# EAGLE design sd shield (EAGLE 7.3.0)
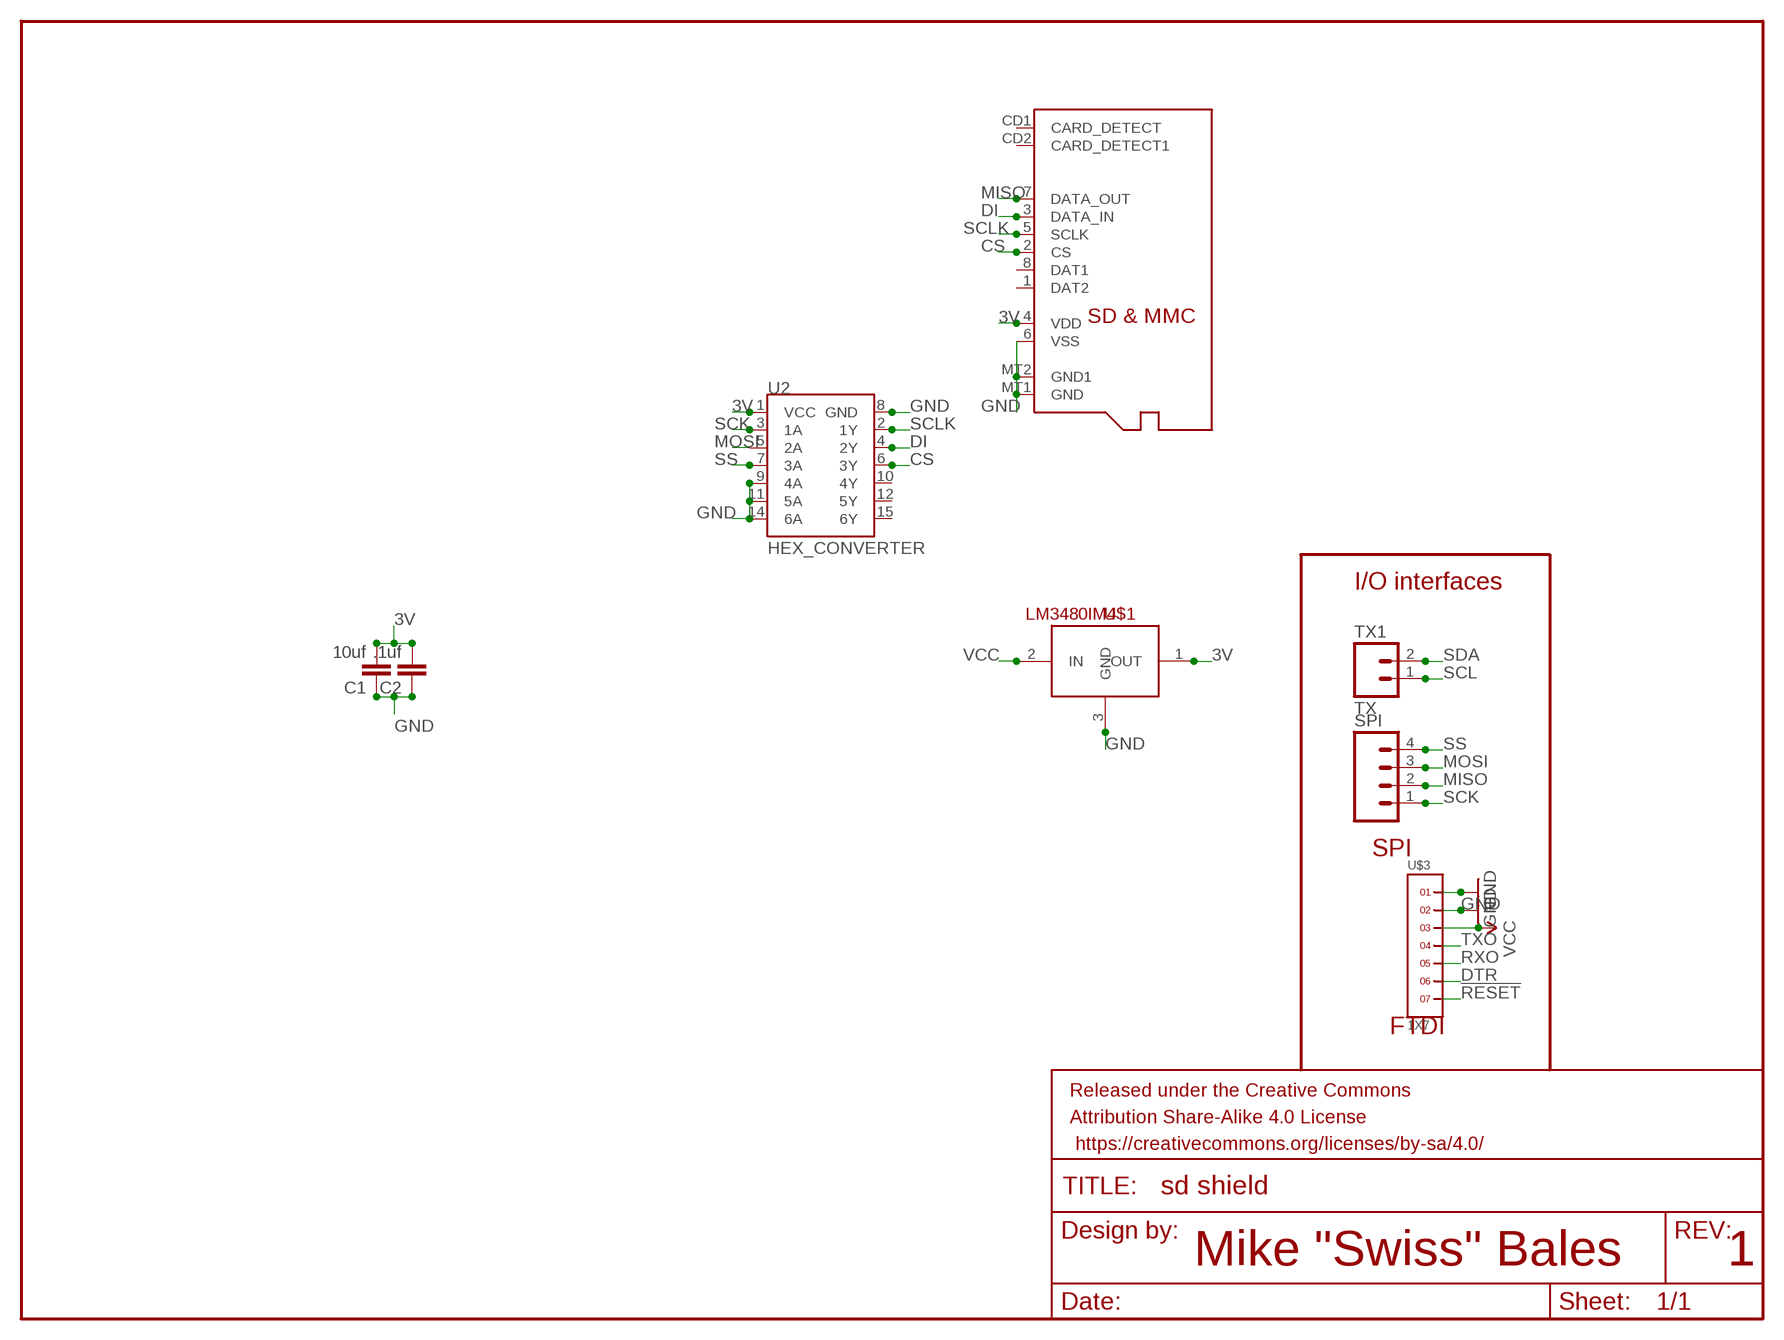
[diagram p0: schematic, sheet 1]

## Parts
C1  10uf  CAP0805  [0805]
C2  .1uf  CAP0805  [0805]
FRAME1  FRAME-LETTER  [CREATIVE_COMMONS]
SPI  M04JST-PTH-VERT  [JST-4-PTH-VERT]
TX1  TX  M02JST-PTH-VERT  [JST-2-PTH-VERT]
U2  HEX_CONVERTER  [SO016]
U$1  LM3480IM4  [SOT23-3]
U$2  MICROSD  [MICROSD]
U$3  1X7  [1X7]

## Nets
3V: C1.2 C2.2 U2.1(VCC) U$1.1(OUT) U$2.4(VDD)
!RESET: U$3.7
CS: U2.6(3Y) U$2.2(CS)
DI: U2.4(2Y) U$2.3(DATA_IN)
DTR: U$3.6
GND: C1.1 C2.1 U2.8(GND) U2.9(4A) U2.11(5A) U2.14(6A) U$1.3(GND) U$2.6(VSS) U$2.MT1(GND) U$2.MT2(GND1) U$3.1 U$3.2
MISO: SPI.2 U$2.7(DATA_OUT)
MOSI: SPI.3 U2.5(2A)
RXO: U$3.5
SCK: SPI.1 U2.3(1A)
SCL: TX1.1
SCLK: U2.2(1Y) U$2.5(SCLK)
SDA: TX1.2
SS: SPI.4 U2.7(3A)
TXO: U$3.4
VCC: U$1.2(IN) U$3.3
Unconnected: U2.10(4Y) U2.12(5Y) U2.15(6Y) U$2.1(DAT2) U$2.8(DAT1) U$2.CD1(CARD_DETECT) U$2.CD2(CARD_DETECT1)

## Notes on the sheet
- I/O interfaces
- SPI
- FTDI
- Mike "Swiss" Bales | 1

## Library data of the parts
C1 C2 = SparkFun-Passives:CAP: Capacitor Standard 0603 ceramic capacitor, and 0.1" leaded capacitor.
FRAME1 = SparkFun-Aesthetics:FRAME-LETTER: Schematic Frame Standard 8.5x11 US Letter frame
SPI = SparkFun-Connectors:M04: Header 4 Standard 4-pin 0.1" header. Use with straight break away headers (SKU : PRT-00116), right angle break away headers (PRT-00553), swiss pins (PRT-00743), machine pins (PRT-00117), and female headers (PRT-00115). Molex polarized connector foot print use with SKU : PRT-08231 with associated crimp pins and housings. 1MM SMD Version SKU: PRT-10208
TX1 = SparkFun-Connectors:M02: Standard 2-pin 0.1" header. Use with - straight break away headers ( PRT-00116) - right angle break away headers (PRT-00553) - swiss pins (PRT-00743) - machine pins (PRT-00117) - female headers (PRT-00115) Molex polarized connector foot print use with: PRT-08233 with associated crimp pins and housings. 2.54_SCREWTERM for use with PRT-10571. 3.5mm Screw Terminal footprints for PRT-08084 5mm Screw Terminal footprints for use with PRT-08432
U2 = SparkFun-DigitalIC:HEX_CONVERTER: 74HC4050 Hex Buffer Level Shifter SMD SO016; PROD_ID: IC-09604
U$1 = SparkFun-PowerIC:LM3480IM4: Small package linear regulator
U$2 = adafruit:MICROSD: Micro-SD / Transflash card holder with SPI pinout For the 3M # 2908-05WB-MG and/or 4UCON #19656 push-push type
U$3 = headers(2mm):1X7

## Board
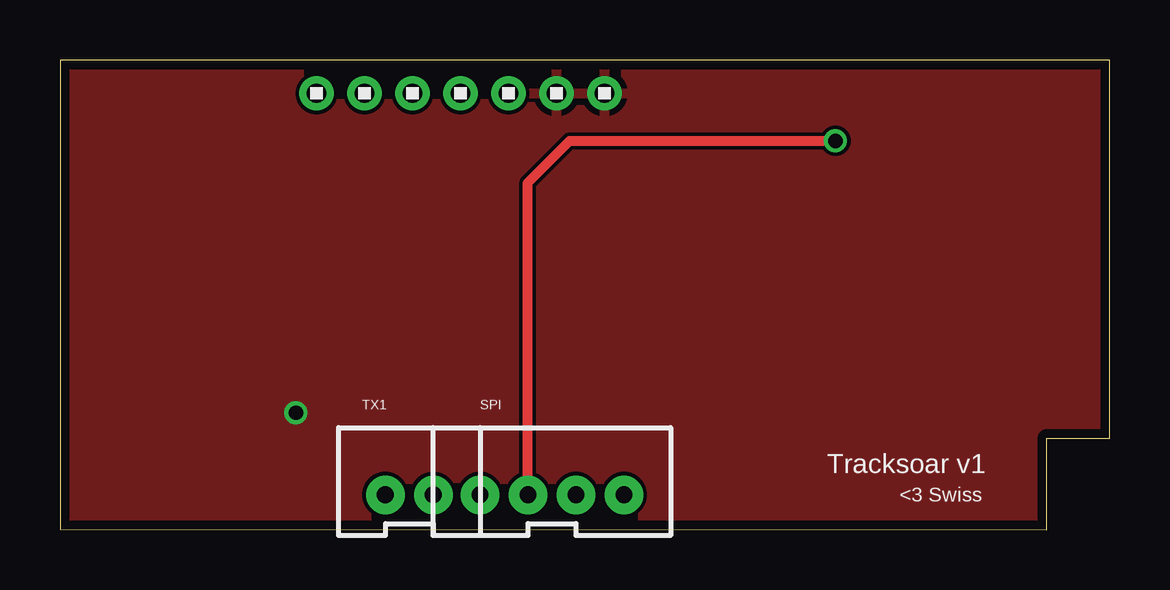
[diagram p1: board, top side]
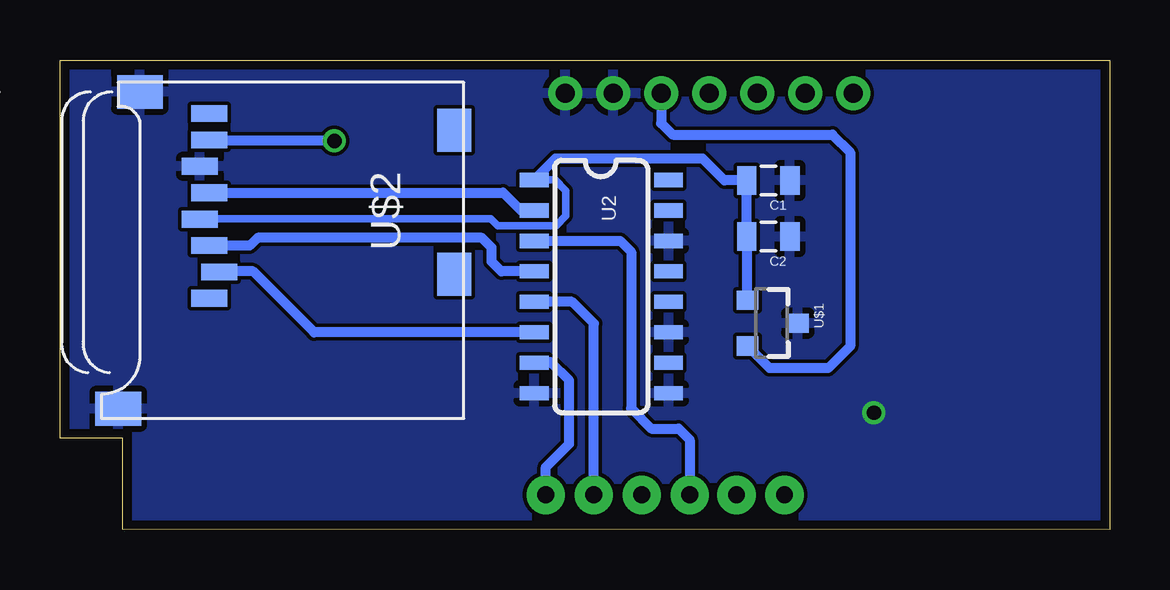
[diagram p2: board, bottom side, seen from below]

Size 43.74 x 19.57 mm. Coordinates in mm from the lower left corner, seen from the top.
Outline: 41.12,0 0,0.03 0,19.57 43.74,19.57 43.74,3.81 41.12,3.81 41.12,0.03
Copper layers (1*16): Top 0.0356mm / dielectric 1.5011mm / Bottom 0.0356mm
Design rules "oshpark-2layer": minimum track width 6mil, minimum drill 13mil, track to track 6mil, track to pad 6mil, pad to pad 6mil, via to via 6mil, smd to smd 6mil, copper to edge 15mil, drill to drill 6mil, minimum pad ring 7mil, minimum via ring 7mil, stop-mask expansion 4mil, vias tented up to drill 0mil, thermal gap 10mil

### Footprints (pad centres in the part's own frame; a part is rotated, then mirrored left to right if it is on the bottom)
0805 = smd 0.8 x 1.2: 1 -0.9,0; 2 0.9,0
JST-4-PTH-VERT = drill 0.7 pad 1.6: 1 -3,-0.55; 2 -1,-0.55; 3 1,-0.55; 4 3,-0.55
JST-2-PTH-VERT = drill 0.7 pad 1.6: 1 -1,-0.55; 2 1,-0.55
SO016 = smd 0.6 x 1.2: 1 -4.445,-2.8; 2 -3.175,-2.8; 3 -1.905,-2.8; 4 -0.635,-2.8; 5 0.635,-2.8; 6 1.905,-2.8; 7 3.175,-2.8; 8 4.445,-2.8; 9 4.445,2.8; 10 3.175,2.8; 11 1.905,2.8; 12 0.635,2.8; 13 -0.635,2.8; 14 -1.905,2.8; 15 -3.175,2.8; 16 -4.445,2.8
SOT23-3 = smd 0.8 x 0.9: 1 -0.95,-1; 2 0.95,-1; 3 0,1.1
MICROSD = smd 0.7 x 1.5: 1 9,-10.64; 2 7.9,-10.24; 3 6.8,-10.64; 4 5.7,-11.04; 5 4.6,-10.64; 6 3.5,-11.04; 7 2.4,-10.64; 8 1.3,-10.64 | smd 1.8 x 1.4: CD1 2,-0.44; CD2 8,-0.44 | smd 1.4 x 1.9: MT1 0.4,-13.54; MT2 13.6,-14.44
1X7 = drill 0.8 pad 1.422: 1 -6,0; 2 -4,0; 3 -2,0; 4 0,0; 5 2,0; 6 4,0; 7 6,0

### Placement (x,y rotation side)
C1  14.22,14.55 180 bottom
C2  14.22,12.22 180 bottom
FRAME1  14.78,-7.8 0 top  (outside the outline)
SPI  20.5,2.01 0 top
TX1  14.55,2.01 0 top
U2  21.18,10.13 270 bottom
U$1  14.1,8.61 270 bottom
U$2  26.87,18.64 270 bottom
U$3  16.69,18.19 180 top

### Tracks (layer width: path | path; a pad name or v marks a point on that pad's centre or on a via)
3V
  Bottom 0.305: U2.1 23.11,14.58 22.66,14.12 22.66,13.08 23.06,12.67 25.5,12.67 25.78,12.95 37.9,12.95 U$2.4
  Bottom 0.406: U$1.1 15.1,12.19 C2.2 C1.2 16.05,14.55 16.97,15.47 23.09,15.47 U2.1
CS
  Bottom 0.406: U2.6 33.15,8.23 35.69,10.77 37.09,10.77 U$2.2
DI
  Bottom 0.406: U2.4 25.35,10.77 25.76,11.18 25.76,11.76 26.16,12.17 35.51,12.17 35.84,11.84 U$2.3
GND  (via drill 0.6)
  other vias: 9.83,4.88
  pour Top: 0,19.58 43.74,19.58 43.74,0 0,0.03 0.05,3.78
  pour Bottom: 0,19.58 43.74,19.58 43.74,0 0,0.03 0.05,3.78
MISO  (via drill 0.6)
  Top 0.406: SPI.2 19.5,14.47 21.23,16.21 v32.31,16.21
  Bottom 0.406: v32.31,16.21 37.47,16.21 U$2.7
MOSI
  Bottom 0.406: SPI.3 21.5,8.59 22.4,9.5 U2.5
SCK
  Bottom 0.406: U2.3 20.4,12.04 19.94,11.58 19.94,5.05 19.1,4.22 17.96,4.22 17.5,3.76 SPI.1
SCLK
  Bottom 0.406: U$2.5 25.27,14.04 24.54,13.31 U2.2
SS
  Bottom 0.406: SPI.4 23.5,2.61 22.53,3.58 22.53,6.22 23.29,6.98 23.96,6.98 U2.7
VCC
  Bottom 0.406: U$3.3 18.69,16.94 18.21,16.46 11.56,16.46 10.82,15.72 10.82,7.65 11.73,6.73 14.17,6.73 U$1.2

### Text on the board
tNames: Tracksoar v1 | <3 Swiss